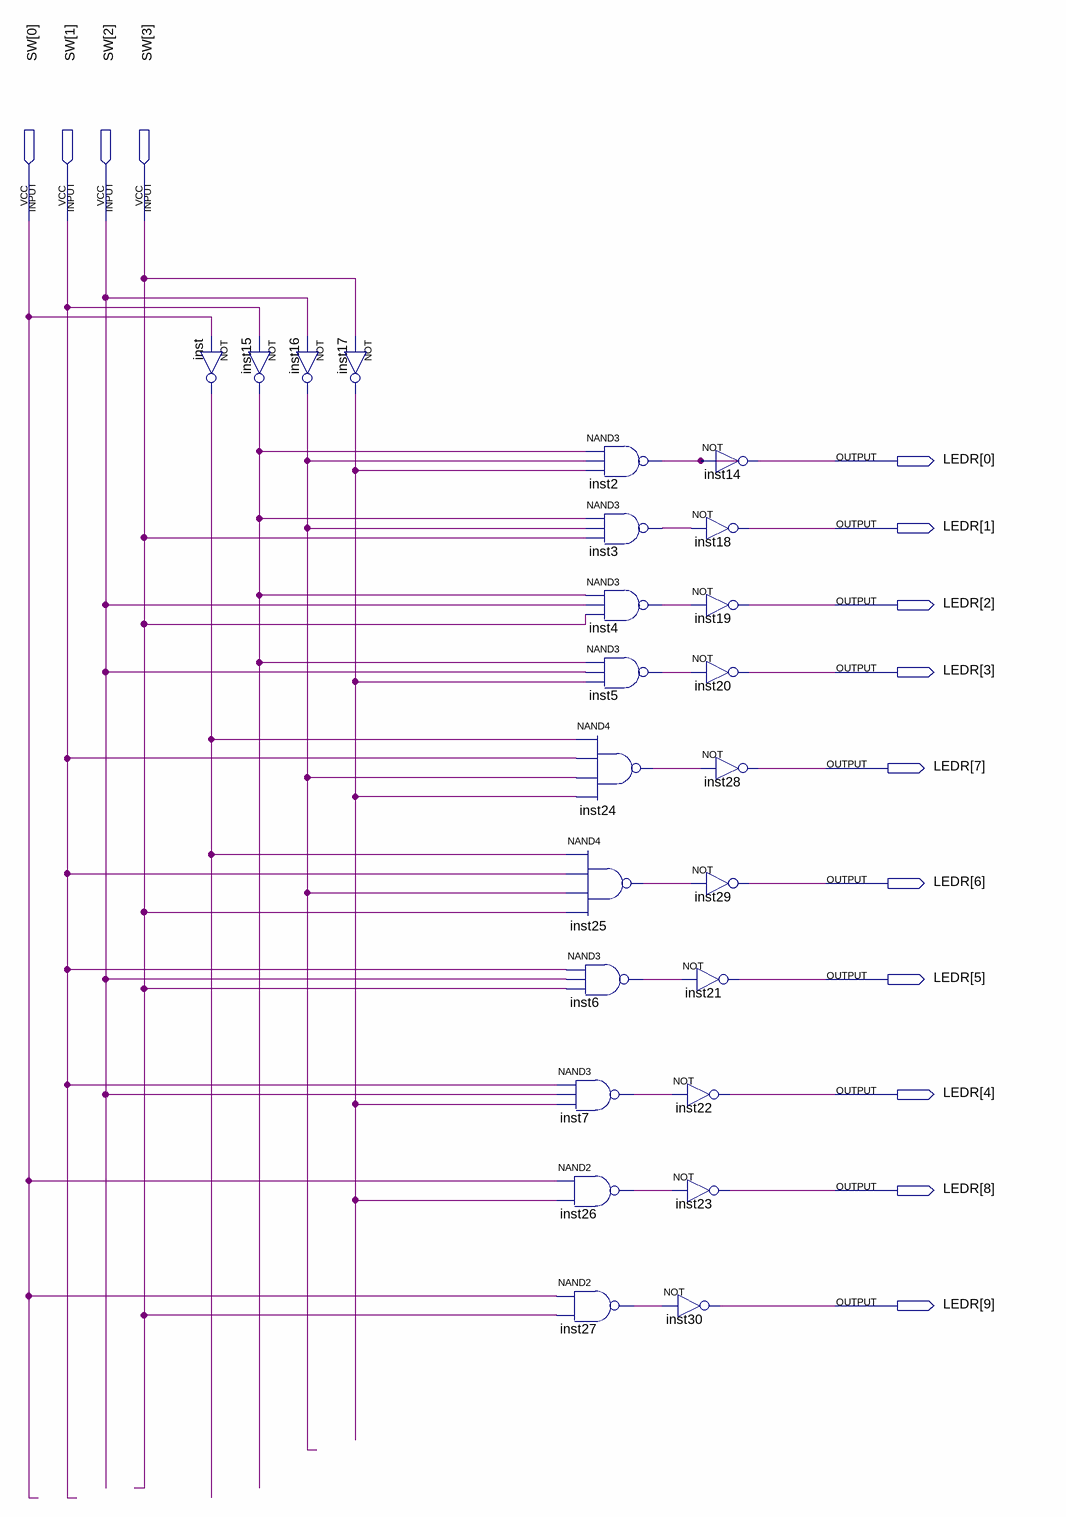
[diagram p0: schematic sheet]
// Quartus schematic decode.bdf as structural Verilog: 24 symbols, 14 pins
module decode (
  input  [3:0] SW,
  output [9:0] LEDR
);

  wire inst2_out, inst3_out, inst4_out, inst5_out, inst6_out, inst7_out, inst15_out, inst16_out, inst17_out,
       inst24_out, inst25_out, inst26_out, inst27_out, inst_out;

  not inst (inst_out, SW[0]);
  not inst15 (inst15_out, SW[1]);
  not inst16 (inst16_out, SW[2]);
  not inst17 (inst17_out, SW[3]);
  nand inst25 (inst25_out, inst_out, SW[1], inst16_out, SW[3]);
  nand inst6 (inst6_out, SW[1], SW[2], SW[3]);
  nand inst7 (inst7_out, SW[1], SW[2], inst17_out);
  nand inst26 (inst26_out, SW[0], inst17_out);
  nand inst27 (inst27_out, SW[0], SW[3]);
  nand inst2 (inst2_out, inst15_out, inst16_out, inst17_out);
  nand inst3 (inst3_out, inst15_out, inst16_out, SW[3]);
  nand inst4 (inst4_out, inst15_out, SW[2], SW[3]);
  nand inst5 (inst5_out, inst15_out, SW[2], inst17_out);
  nand inst24 (inst24_out, inst_out, SW[1], inst16_out, inst17_out);
  not inst14 (LEDR[0], inst2_out);
  not inst18 (LEDR[1], inst3_out);
  not inst19 (LEDR[2], inst4_out);
  not inst20 (LEDR[3], inst5_out);
  not inst28 (LEDR[7], inst24_out);
  not inst29 (LEDR[6], inst25_out);
  not inst21 (LEDR[5], inst6_out);
  not inst22 (LEDR[4], inst7_out);
  not inst23 (LEDR[8], inst26_out);
  not inst30 (LEDR[9], inst27_out);
endmodule
